# EasyEDA Pro project 高速串口TTL转CAN.eprj

# Schematic Schematic1
Create Date: 2024-04-29; Page Name: P1; Project Name: 高速串口TTL转CAN; Schematic Name: Schematic1; Update Date: 2024-04-30; Company: 嘉立创EDA; Page Size: A4; Version: V1.0
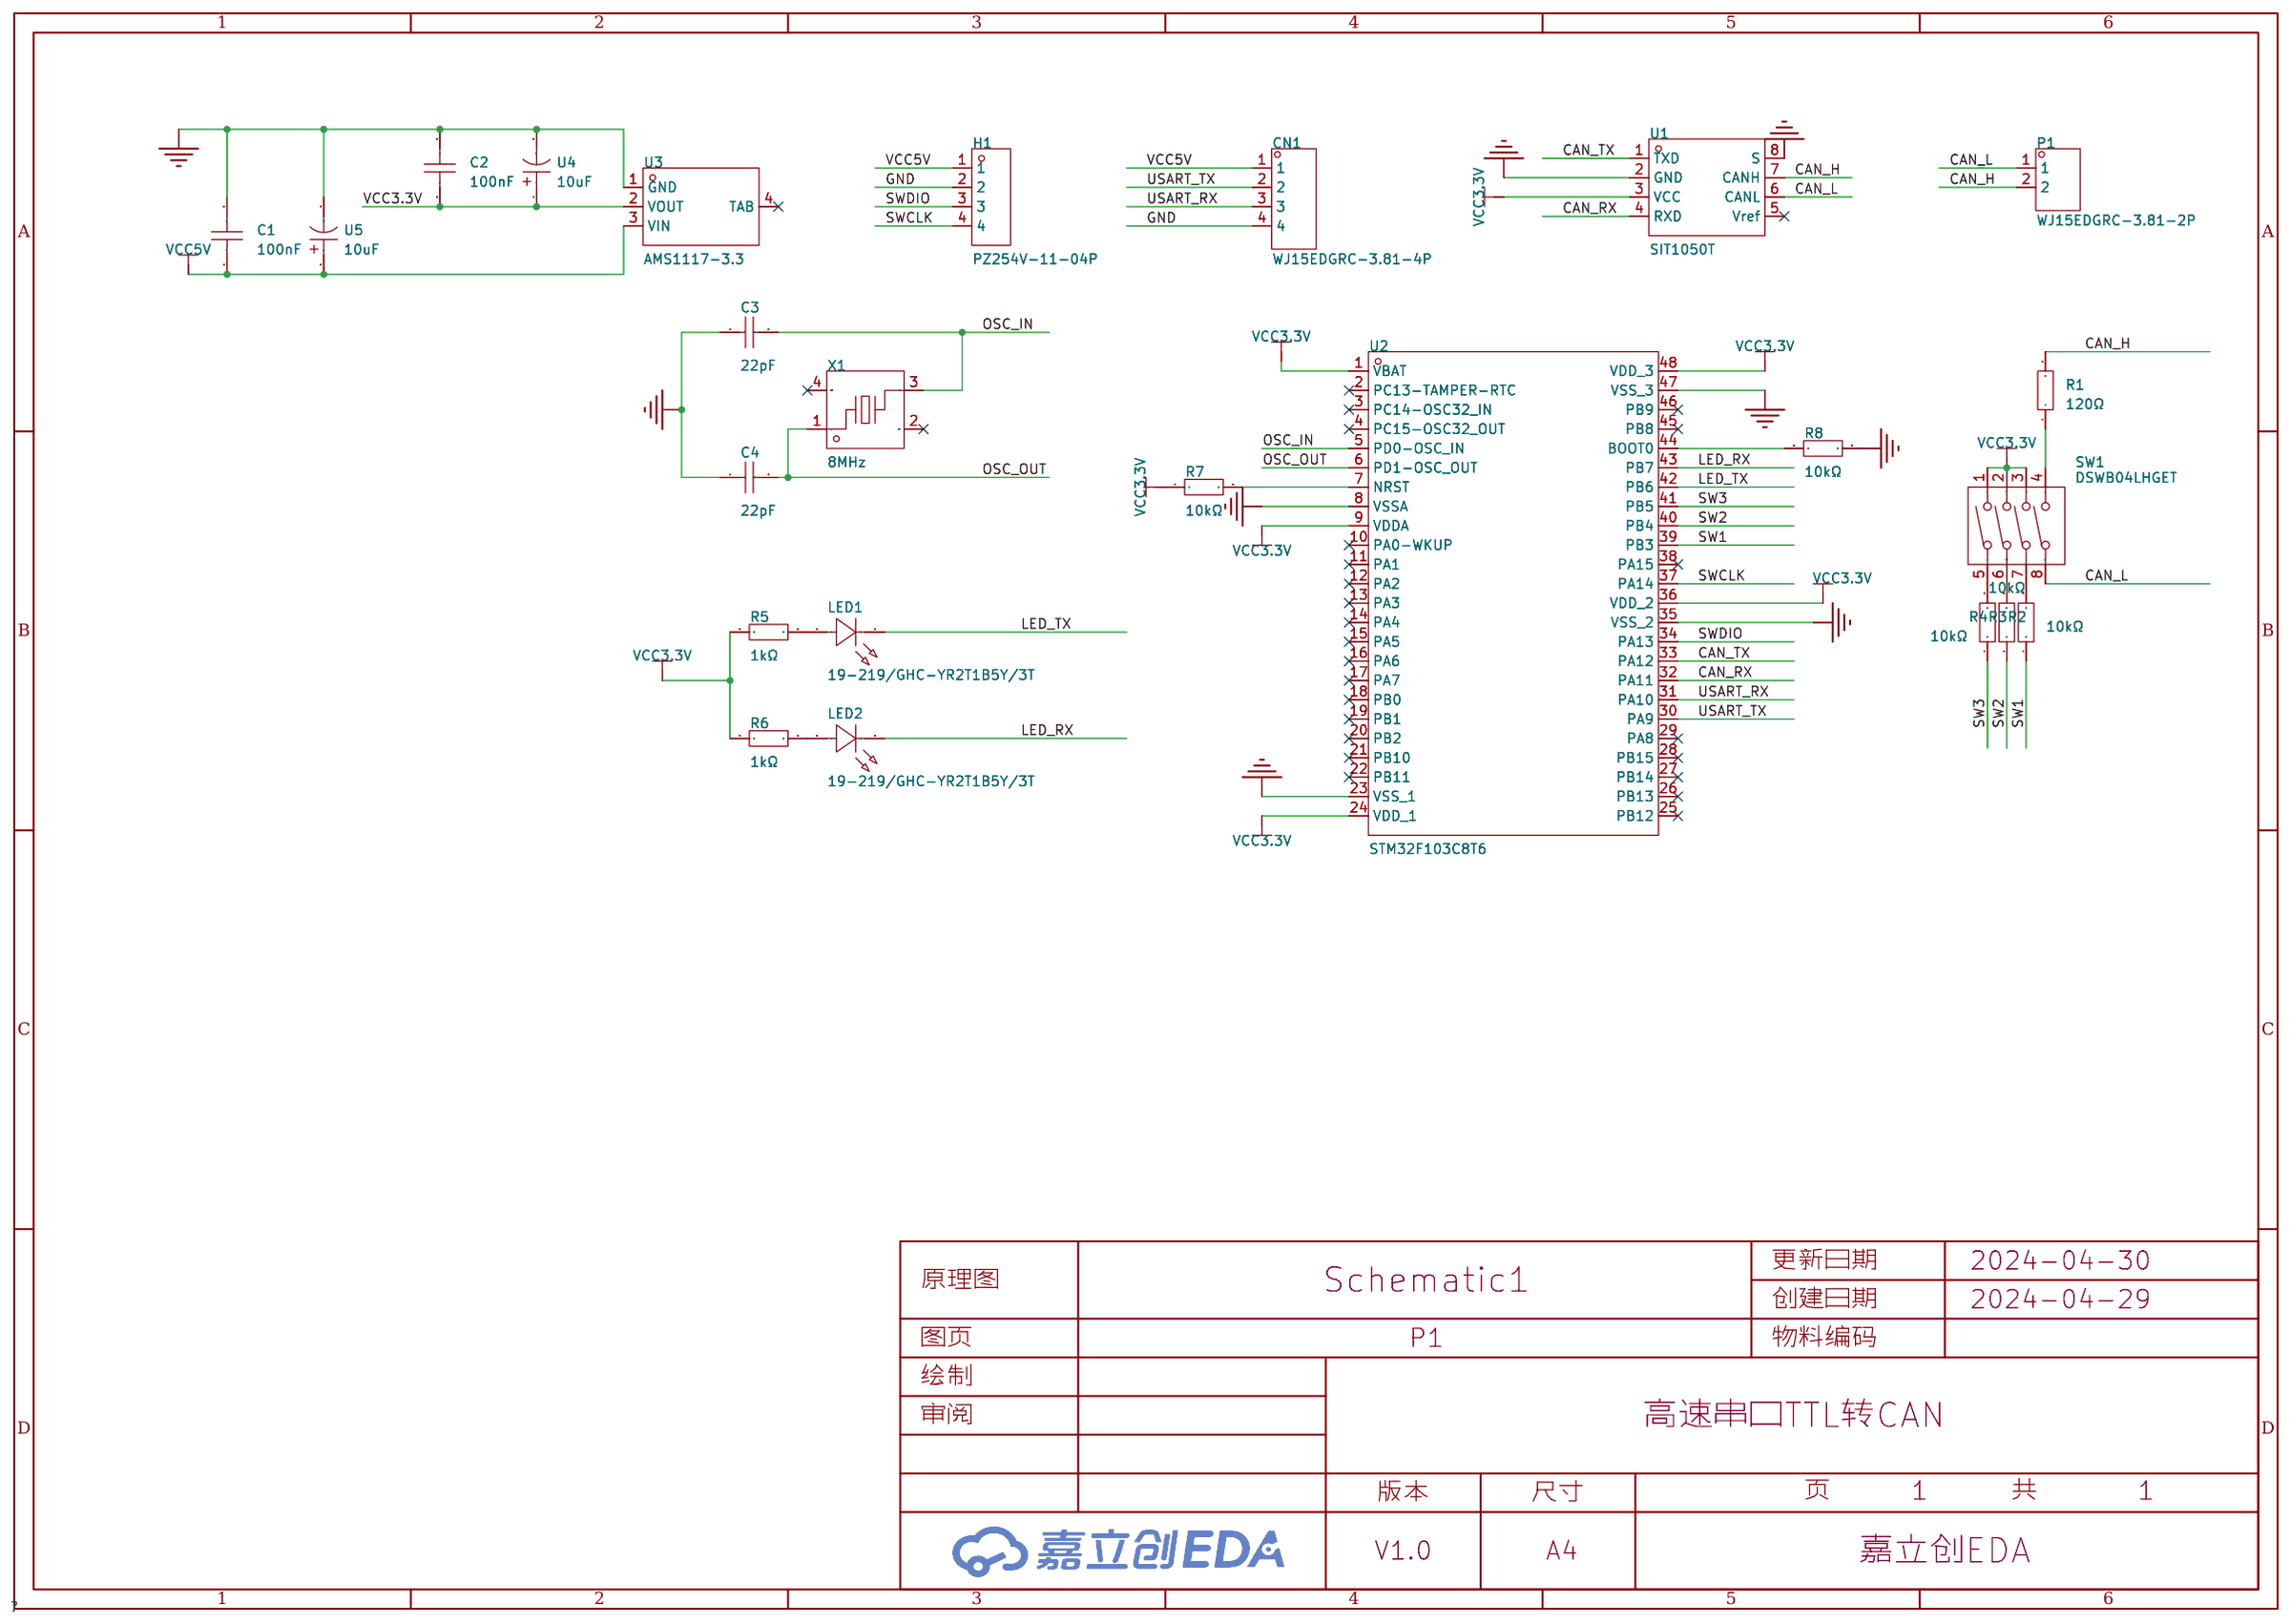
[diagram p0: schematic sheet]

## Parts
C1  100nF  [C0603]
C2  100nF  [C0603]
C3  22pF  [C0603]
C4  22pF  [C0603]
CN1  WJ15EDGRC-3.81-4P  [CONN-TH_WJ15EDGRC-3.81-4P]
H1  PZ254V-11-04P  [HDR-TH_4P-P2.54-V-M]
LED1  19-219/GHC-YR2T1B5Y/3T  [LED0603-RD_GREEN]
LED2  19-219/GHC-YR2T1B5Y/3T  [LED0603-RD_GREEN]
P1  WJ15EDGRC-3.81-2P  [CONN-TH_2P-P3.81_WJ15EDGRC-3.81-2P]
R1  120Ω  [R0603]
R2  10kΩ  [R0603]
R3  10kΩ  [R0603]
R4  10kΩ  [R0603]
R5  1kΩ  [R0603]
R6  1kΩ  [R0603]
R7  10kΩ  [R0603]
R8  10kΩ  [R0603]
SW1  DSWB04LHGET  [SW-TH_DSWB04LHGET]
U1  SIT1050T  [SO-8_L4.9-W3.9-P1.27-LS5.9-BL]
U2  STM32F103C8T6  [LQFP-48_L7.0-W7.0-P0.50-LS9.0-BL]
U3  AMS1117-3.3  [SOT-223-3_L6.5-W3.5-P3.05-LS7.0]
U4  10uF  [CAP-SMD_L2.0-W1.3-FD]
U5  10uF  [CAP-SMD_L2.0-W1.3-FD]
X1  8MHz  [OSC-SMD_4P-L3.2-W2.5-BL]

## Library data of the parts
C1 C2 = CC0603KRX7R9BB104: 容值:100nF;精度:±10%;额定电压:50V;材质(温度系数):X7R;; LCSC Part Name: 100nF ±10% 50V; Supplier Part: C14663; Manufacturer: YAGEO(国巨); Supplier Footprint: 0603; JLCPCB Part Class: 基础库; Datasheet: https://atta.szlcsc.com/upload/public/pdf/source/20180910/C282072_33301C7F631E79921B82A8DAC6BCC5B3.pdf; Supplier: LCSC; Tolerance: ±10%; Voltage Rated: 50V; Temperature Coefficient: X7R
C3 C4 = CC0603JRNPO9BN220: 容值:22pF;精度:±5%;额定电压:50V;材质(温度系数):NP0;; LCSC Part Name: 22pF ±5% 50V; Supplier Part: C105620; Manufacturer: YAGEO(国巨); Supplier Footprint: 0603; JLCPCB Part Class: 扩展库; Datasheet: https://atta.szlcsc.com/upload/public/pdf/source/20170505/1493957838062.pdf; Supplier: LCSC; Tolerance: ±5%; Voltage Rated: 50V; Temperature Coefficient: NP0
CN1 = WJ15EDGRC-3.81-4P: 连接器类型:板端/插座-闭口;结构:1x4P;间距:3.81mm;颜色:绿色;安装方式:弯针;排数:1;每排PIN数:4;; LCSC Part Name: 3.81mm 1x4P 排数:1 每排P数:4; Supplier Part: C7245; Manufacturer: KANGNEX(康奈克斯电气); Supplier Footprint: 弯插,P=3.81mm; JLCPCB Part Class: 扩展库; Datasheet: https://atta.szlcsc.com/upload/public/pdf/source/20191225/C7245_837ECEBE031BAC19A7EBD4F3127022E5.pdf; Supplier: LCSC; Connector Type: 板端/插座-闭口; Structure: 1x4P; Pitch: 3.81mm; Color: 绿色; Mounting Style: 弯针; Number of Rows: 1; Number of PINs Per Row: 4
H1 = PZ254V-11-04P: 插针结构:1x4P;间距:2.54mm;行距:-;圆针/方针:方针;安装类型:直插;排数:单排;总PIN位数:4P;额定电流:3A;额定电压:250V;配合针长度:6mm;塑高:2.5mm;端接针长度:3mm;触头材质:-;工作温度范围:-40℃~+105℃;颜色:黑色;; LCSC Part Name: 间距:2.54mm 1x4P 直插 方针; Supplier Part: C2691448; Manufacturer: XFCN(兴飞); Supplier Footprint: 插件,P=2.54mm; JLCPCB Part Class: 扩展库; Datasheet: https://atta.szlcsc.com/upload/public/pdf/source/20200309/C492403_F9F19131791D08044AD4F84F8E751A34.pdf; Supplier: LCSC; Pin Structure: 1x4P; Pitch: 2.54mm; Circluar Pins/Square Pins: 方针; Mounting Type: 直插; Number of Rows: 单排; Number of Pins: 4P; Current Rating (Max): 3A; Voltage Rating (Max): 250V; Length of Mating Pin: 6mm; Insulation Height: 2.5mm; Length of End Connection Pin: 3mm; Operating Temperature Range: -40℃~+105℃; Color: 黑色
LED1 LED2 = 19-219/GHC-YR2T1B5Y/3T: 发光颜色:绿色;正向电流:20mA;主波长:518nm;透镜颜色:无色透明透镜;; LCSC Part Name: 0603正贴式 绿灯(Iv=140~360mcd) @IF=20mA); Supplier Part: C2994781; Manufacturer: EVERLIGHT(亿光); Supplier Footprint: 0603; JLCPCB Part Class: 扩展库; Datasheet: https://atta.szlcsc.com/upload/public/pdf/source/20220419/8956FAA3247BD76AC23F3FF602030F9E.pdf; Supplier: LCSC; Emitted Color: 绿色; Forward Current: 20mA; Dominant Wavelength: 518nm; Peak Wavelength: 525nm; Lens Color: 无色透明透镜
P1 = WJ15EDGRC-3.81-2P: 连接器类型:板端/插座-闭口;结构:1x2P;间距:3.81mm;颜色:绿色;安装方式:弯针;排数:1;每排PIN数:2;; LCSC Part Name: 3.81mm 1x2P 排数:1 每排P数:2; Supplier Part: C8387; Manufacturer: KANGNEX(康奈克斯电气); Supplier Footprint: 弯插,P=3.81mm; JLCPCB Part Class: 扩展库; Datasheet: https://atta.szlcsc.com/upload/public/pdf/source/20191225/C8387_8EBAF10345D2762F0167C8753398EEFA.pdf; Supplier: LCSC; Connector Type: 板端/插座-闭口; Structure: 1x2P; Pitch: 3.81mm; Color: 绿色; Mounting Style: 弯针; Number of Rows: 1; Number of PINs Per Row: 2
R1 = 0603WAF1200T5E: 电阻类型:厚膜电阻;阻值:120Ω;精度:±1%;功率:100mW;最大工作电压:75V;温度系数:±100ppm/℃;; LCSC Part Name: 120Ω ±1% 100mW 厚膜电阻; Supplier Part: C22787; Manufacturer: UNI-ROYAL(厚声); Supplier Footprint: 0603; JLCPCB Part Class: 基础库; Datasheet: https://atta.szlcsc.com/upload/public/pdf/source/20200306/C422600_1E6D84923E4A46A82E41ADD87F860B5C.pdf; Supplier: LCSC; Type: 厚膜电阻; Tolerance: ±1%; Power(Watts): 100mW; Overload Voltage (Max): 75V; Temperature Coefficient: ±100ppm/℃; Operating Temperature Range: -55℃~+155℃
R2-R4 R7 R8 = 0603WAF1002T5E: 电阻类型:厚膜电阻;阻值:10kΩ;精度:±1%;功率:100mW;最大工作电压:75V;温度系数:±100ppm/℃;; LCSC Part Name: 厚膜电阻 10kΩ ±1% 100mW; Supplier Part: C25804; Manufacturer: UNI-ROYAL(厚声); Supplier Footprint: 0603; JLCPCB Part Class: 基础库; Datasheet: https://atta.szlcsc.com/upload/public/pdf/source/20200306/C422600_1E6D84923E4A46A82E41ADD87F860B5C.pdf; Supplier: LCSC; Type: 厚膜电阻; Tolerance: ±1%; Power(Watts): 100mW; Overload Voltage (Max): 75V; Temperature Coefficient: ±100ppm/℃; Operating Temperature Range: -55℃~+155℃
R5 R6 = 0603WAF1001T5E: 电阻类型:厚膜电阻;阻值:1kΩ;精度:±1%;功率:100mW;最大工作电压:75V;温度系数:±100ppm/℃;; LCSC Part Name: 1kΩ ±1% 100mW 厚膜电阻; Supplier Part: C21190; Manufacturer: UNI-ROYAL(厚声); Supplier Footprint: 0603; JLCPCB Part Class: 基础库; Datasheet: https://atta.szlcsc.com/upload/public/pdf/source/20200306/C422600_1E6D84923E4A46A82E41ADD87F860B5C.pdf; Supplier: LCSC; Type: 厚膜电阻; Tolerance: ±1%; Power(Watts): 100mW; Overload Voltage (Max): 75V; Temperature Coefficient: ±100ppm/℃; Operating Temperature Range: -55℃~+155℃
SW1 = DSWB04LHGET: 类型:平拨,凸起式;电路结构:单刀单掷;开关位数:4位;使用寿命:-;颜色:红色;; LCSC Part Name: 间距2.54mm 平拨,凸起式 4位拨码开关; Supplier Part: C99418; Manufacturer: YE; Supplier Footprint: 插件; JLCPCB Part Class: 扩展库; Datasheet: https://atta.szlcsc.com/upload/public/pdf/source/20220830/02827E67A8727938D957A3CE4C86C92D.pdf; Supplier: LCSC; Type: 平拨,凸起式; Circuit: 单刀单掷; Number of Positions: 4位; Lead Pitch: 2.54mm; Color: 红色
U1 = SIT1050T: 类型:收发器;数据速率:1Mbps;; LCSC Part Name: 1Mbps 4.5V~5.5V; Supplier Part: C313021; Manufacturer: SIT(芯力特); Supplier Footprint: SO-8; JLCPCB Part Class: 扩展库; Datasheet: https://atta.szlcsc.com/upload/public/pdf/source/20190522/C313021_F295A63AE262020D1D58DBA99C3629E3.pdf; Supplier: LCSC; Type: 收发器; Data Rate: 1Mbps; Supply Voltage: 4.5V~5.5V
U2 = STM32F103C8T6: CPU内核:CM3;程序存储容量:64KB;RAM总容量:20KB;GPIO端口数量:37;工作电压范围:2V~3.6V;CPU最大主频:72MHz;程序存储器类型:FLASH;; LCSC Part Name: STM32F103C8T6 MSL=3; Supplier Part: C8734; Manufacturer: ST(意法半导体); Supplier Footprint: LQFP-48(7x7); JLCPCB Part Class: 扩展库; Datasheet: https://atta.szlcsc.com/upload/public/pdf/source/20220812/8363ACEC51AD55ECEB84799464F7CB85.pdf; Supplier: LCSC; CPU Core: CM3; Program Storage Size: 64KB; RAM Size: 20KB; GPIO Ports Number: 37; Operating Voltage Range: 2V~3.6V; CPU Maximum Speed: 72MHz; Program Memory Type: FLASH; Operating Temperature Range: -40℃~+85℃; ADC (Bit): 12bit; Universal Serial Bus: 有; Peripheral/Function: 看门狗；DMA；看门狗；片载温度传感器; Watchdog: 有; Infrared Data Association: 有; Low-Voltage Detect: 有; Direct Memory Access: 有; Internal Oscillator: 有
U3 = AMS1117-3.3_C5250992: 输出类型：固定 输出极性：正 最大输入电压：18V 输出电压：3.3V 输出电流：1A 电源纹波抑制比(PSRR)：60dB@(120Hz)。当前应用较多领域：三端稳压器，机顶盒; Supplier Part: C5250992; Manufacturer: TWGMC(台湾迪嘉); Supplier Footprint: SOT-223-3L; JLCPCB Part Class: 扩展库; Datasheet: https://atta.szlcsc.com/upload/public/pdf/source/20221109/A58A92B07670E85D28928AE371260E8D.pdf; Supplier: LCSC
U4 U5 = F921A106MPA: 容值:10uF;精度:±20%;额定电压:10V;等效串联电阻:6Ω@100kHz;; LCSC Part Name: 10uF ±20% 10V; Supplier Part: C1955037; Manufacturer: Kyocera AVX; Supplier Footprint: 0805; JLCPCB Part Class: 扩展库; Datasheet: https://atta.szlcsc.com/upload/public/pdf/source/20211207/7C5E2E325E512F406E5C86958F1291E6.pdf; Supplier: LCSC; Tolerance: ±20%; Rated Voltage: 10V; Leakage Current(DCL): 500nA@20℃,1min; Ripple Current: 28mA@100kHz; Equivalent Series Resistance(ESR): 6Ω@100kHz; Operating Temperature: -55℃~+125℃
X1 = X32258MOB4SI: 晶振类型:贴片晶振;频率:8MHz;常温频差:±10ppm;外接负载电容:12pF;频率稳定度(全温):±20ppm;; LCSC Part Name: 8MHz ±10ppm 12pF; Supplier Part: C2682775; Manufacturer: YXC(扬兴晶振); Supplier Footprint: SMD3225-4P; JLCPCB Part Class: 扩展库; Datasheet: https://atta.szlcsc.com/upload/public/pdf/source/20240329/19D5F850207469550BEB00D7DFEDBC7A.pdf; Supplier: LCSC; Crystal Type: 贴片晶振; Normal temperature Frequency Tolerance: ±10ppm; External load capacitor: 12pF; Frequency Stability(Full temperature range): ±20ppm; Equivalent Series Resistance (ESR): 150Ω; Operating Temperature: -40℃~+85℃

## Nets
GND: C1.2 C2.2 C3.1 C4.1 CN1.4 H1.2 R8.2 U1.2(GND) U1.8(S) U2.8(VSSA) U2.23(VSS_1) U2.35(VSS_2) U2.47(VSS_3) U3.1(GND) U4.2 U5.2
VCC3.3V: C2.1 R5.1 R6.1 R7.1 SW1.1 SW1.2 SW1.3 U1.3(VCC) U2.1(VBAT) U2.9(VDDA) U2.24(VDD_1) U2.36(VDD_2) U2.48(VDD_3) U3.2(VOUT) U4.1
VCC5V: C1.1 CN1.1 H1.1 U3.3(VIN) U5.1
CAN_H: P1.2 R1.2 U1.7(CANH)
CAN_L: P1.1 SW1.8 U1.6(CANL)
CAN_RX: U1.4(RXD) U2.32(PA11)
CAN_TX: U1.1(TXD) U2.33(PA12)
LED_RX: LED2.1(K) U2.43(PB7)
LED_TX: LED1.1(K) U2.42(PB6)
OSC_IN: C3.2 U2.5(PD0-OSC_IN) X1.3
OSC_OUT: C4.2 U2.6(PD1-OSC_OUT) X1.1
SW1: R2.1 U2.39(PB3)
SW2: R3.1 U2.40(PB4)
SW3: R4.1 U2.41(PB5)
SWCLK: H1.4 U2.37(PA14)
SWDIO: H1.3 U2.34(PA13)
USART_RX: CN1.3 U2.31(PA10)
USART_TX: CN1.2 U2.30(PA9)
$1N1995: R1.1 SW1.4
$1N2288: LED1.2(A) R5.2
$1N2327: LED2.2(A) R6.2
$1N2517: R7.2 U2.7(NRST)
$1N2596: R8.1 U2.44(BOOT0)
$1N3262: R4.2 SW1.5
$1N3264: R3.2 SW1.6
$1N3266: R2.2 SW1.7

Not connected (* = marked no-connect by the designer): U1 5(Vref)*; U2 2(PC13-TAMPER-RTC)* 3(PC14-OSC32_IN)* 4(PC15-OSC32_OUT)* 10(PA0-WKUP)* 11(PA1)* 12(PA2)* 13(PA3)* 14(PA4)* 15(PA5)* 16(PA6)* 17(PA7)* 18(PB0)* 19(PB1)* 20(PB2)* 21(PB10)* 22(PB11)* 25(PB12)* 26(PB13)* 27(PB14)* 28(PB15)* 29(PA8)* 38(PA15)* 45(PB8)* 46(PB9)*; U3 4(TAB)*; X1 2(GND)* 4(GND)*

# Board PCB1
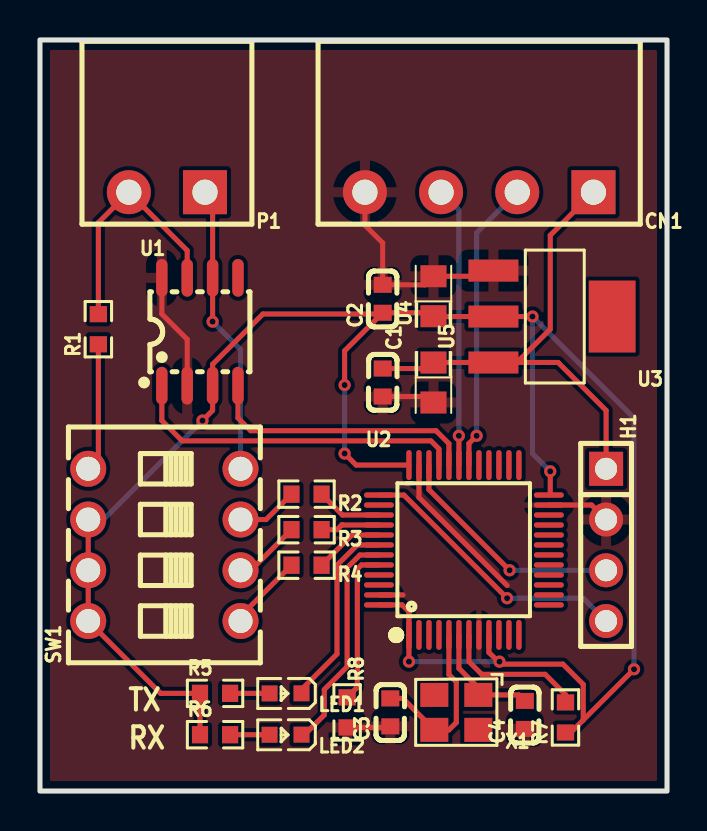
[diagram p1: board, top side]
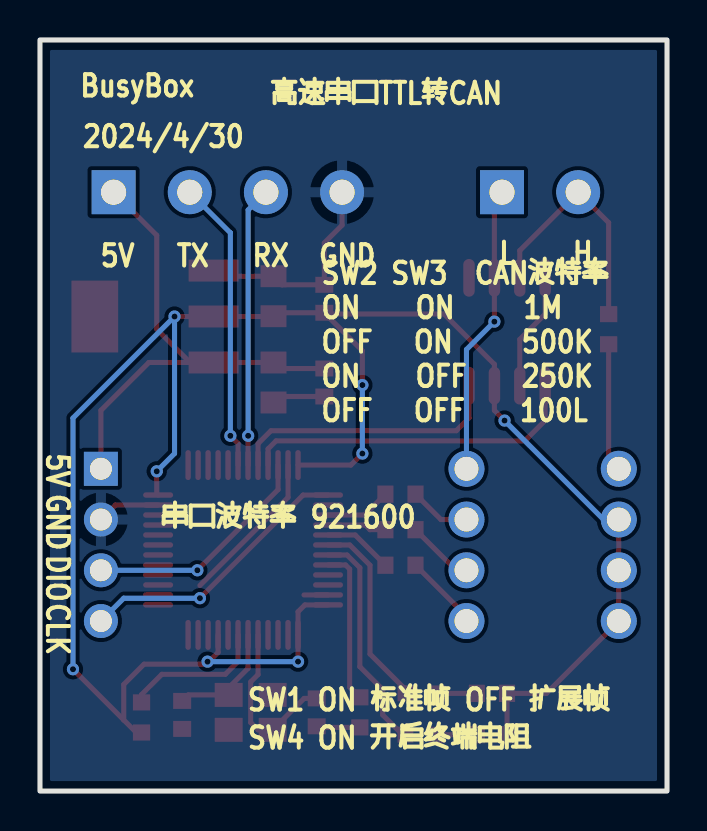
[diagram p2: board, bottom side, seen from below]

Outline 31.37 x 37.59 mm; copper layers: Top Layer, Bottom Layer. Coordinates in mm from the lower left corner of the outline.
Outline path: rectangle 0,37.59 31.37,0
Stack: Top Layer 0.035mm / Dielectric1 1.51mm FR4 er 4.5 / Bottom Layer 0.035mm

## Design rules (mm)
template: JLCPCB Capability(Two Layers Board)
spacing copperThickness1oz (default): track to track 0.102, other pairs 0.152 to 0.3
spacing copperThickness2oz: track to track 0.203, other pairs 0.152 to 0.3
track width copperThickness1oz (default): min 0.127, default 0.254, max 2.54
track width copperThickness2oz: min 0.203, default 0.254, max 2.54
differential pair differentialPair (default): width min 0.127, default 0.254, max 2.54; gap min 0.152, default 0.152
via viaSize (default): diameter min 0.5, default 0.61, max 10; hole min 0.3, default 0.305, max 6.3

## Placement (name value [footprint] x y rotation side)
C1  100nF  [C0603]  17.15 20.45 270 top
C2  100nF  [C0603]  17.15 24.64 90 top
C3  22pF  [C0603]  17.53 3.94 90 top
C4  22pF  [C0603]  24.26 3.81 90 top
CN1  WJ15EDGRC-3.81-4P  [CONN-TH_WJ15EDGRC-3.81-4P]  21.97 29.97 180 top
H1  PZ254V-11-04P  [HDR-TH_4P-P2.54-V-M]  28.32 12.32 270 top
LED1  19-219/GHC-YR2T1B5Y/3T  [LED0603-RD_GREEN]  12.28 4.89 180 top
LED2  19-219/GHC-YR2T1B5Y/3T  [LED0603-RD_GREEN]  12.28 2.82 180 top
P1  WJ15EDGRC-3.81-2P  [CONN-TH_2P-P3.81_WJ15EDGRC-3.81-2P]  6.35 29.97 180 top
R1  120Ω  [R0603]  2.92 23.11 90 top
R2  10kΩ  [R0603]  13.34 14.86 180 top
R3  10kΩ  [R0603]  13.34 13.08 180 top
R4  10kΩ  [R0603]  13.34 11.3 180 top
R5  1kΩ  [R0603]  8.76 4.89 0 top
R6  1kΩ  [R0603]  8.76 2.82 0 top
R7  10kΩ  [R0603]  26.29 3.68 90 top
R8  10kΩ  [R0603]  15.37 3.94 270 top
SW1  DSWB04LHGET  [SW-TH_DSWB04LHGET]  6.22 12.32 90 top
U1  SIT1050T  [SO-8_L4.9-W3.9-P1.27-LS5.9-BL]  8 22.99 0 top
U2  STM32F103C8T6  [LQFP-48_L7.0-W7.0-P0.50-LS9.0-BL]  21.21 12.06 0 top
U3  AMS1117-3.3  [SOT-223-3_L6.5-W3.5-P3.05-LS7.0]  25.65 23.75 180 top
U4  10uF  [CAP-SMD_L2.0-W1.3-FD]  19.69 24.77 90 top
U5  10uF  [CAP-SMD_L2.0-W1.3-FD]  19.69 20.45 270 top
X1  8MHz  [OSC-SMD_4P-L3.2-W2.5-BL]  20.83 3.94 180 top

## Footprints (pads in the part's own frame, mm; a bottom-side part is the same pattern mirrored in y, then rotated)
C0603
  rect 0.8x0.9 smd: 1(-0.7,0) 2(0.7,0)
CAP-SMD_L2.0-W1.3-FD
  rect 1.1x1.3 smd: 1(-1,0) 2(1,0)
CONN-TH_2P-P3.81_WJ15EDGRC-3.81-2P
  rect 2.2x2.2 hole 1.26: 1(-1.905,0)
  round 2.2 hole 1.26: 2(1.905,0)
CONN-TH_WJ15EDGRC-3.81-4P
  rect 2.2x2.2 hole 1.26: 1(-5.715,0)
  round 2.2 hole 1.26: 2(-1.905,0) 3(1.905,0) 4(5.715,0)
HDR-TH_4P-P2.54-V-M
  rect 1.7x1.7 hole 1.1: 1(-3.81,0)
  round 1.7 hole 1.1: 2(-1.27,0) 3(1.27,0) 4(3.81,0)
LED0603-RD_GREEN
  rect 0.8x0.8 smd: 1(-0.799,-0.004) 2(0.799,0.004)
LQFP-48_L7.0-W7.0-P0.50-LS9.0-BL
  oval 0.27x1.5 smd: 1(-2.75,-4.25) 2(-2.25,-4.25) 3(-1.75,-4.25) 4(-1.25,-4.25) 5(-0.75,-4.25) 6(-0.25,-4.25) 7(0.25,-4.25) 8(0.75,-4.25) 9(1.25,-4.25) 10(1.75,-4.25) 11(2.25,-4.25) 12(2.75,-4.25) 25(2.75,4.25) 26(2.25,4.25) 27(1.75,4.25) 28(1.25,4.25) 29(0.75,4.25) 30(0.25,4.25) 31(-0.25,4.25) 32(-0.75,4.25) 33(-1.25,4.25) 34(-1.75,4.25) 35(-2.25,4.25) 36(-2.75,4.25)
  oval 1.5x0.27 smd: 13(4.25,-2.75) 14(4.25,-2.25) 15(4.25,-1.75) 16(4.25,-1.25) 17(4.25,-0.75) 18(4.25,-0.25) 19(4.25,0.25) 20(4.25,0.75) 21(4.25,1.25) 22(4.25,1.75) 23(4.25,2.25) 24(4.25,2.75) 37(-4.25,2.75) 38(-4.25,2.25) 39(-4.25,1.75) 40(-4.25,1.25) 41(-4.25,0.75) 42(-4.25,0.25) 43(-4.25,-0.25) 44(-4.25,-0.75) 45(-4.25,-1.25) 46(-4.25,-1.75) 47(-4.25,-2.25) 48(-4.25,-2.75)
OSC-SMD_4P-L3.2-W2.5-BL
  rect 1.4x1.2 smd: 1(-1.1,-0.875) 2(1.1,-0.875) 3(1.1,0.875) 4(-1.1,0.875)
R0603
  rect 0.806x0.864 smd: 1(-0.753,0) 2(0.753,0)
SO-8_L4.9-W3.9-P1.27-LS5.9-BL
  oval 0.574x1.888 smd: 1(-1.905,-2.699) 2(-0.635,-2.699) 3(0.635,-2.699) 4(1.905,-2.699) 5(1.905,2.699) 6(0.635,2.699) 7(-0.635,2.699) 8(-1.905,2.699)
SOT-223-3_L6.5-W3.5-P3.05-LS7.0
  rect 2.5x1.1 smd: 1(2.97,-2.3) 2(2.97,0) 3(2.97,2.3)
  rect 2.34x3.6 smd: 4(-2.97,0)
SW-TH_DSWB04LHGET
  round 1.8 hole 1.2: 1(-3.81,3.81) 2(-1.27,3.81) 3(1.27,3.81) 4(3.81,3.81) 5(-3.81,-3.81) 6(-1.27,-3.81) 7(1.27,-3.81) 8(3.81,-3.81)

## Nets
As in the schematic.

Pads without a net: U1 5; U2 2 3 4 10 11 12 13 14 15 16 17 18 19 20 21 22 25 26 27 28 29 38 45 46; U3 4; X1 2 4

## Via types
v1: diameter 0.61, hole 0.305, Top Layer to Bottom Layer, 13 vias

## Routing (per net, layer and track width the routed paths; a pad name or vN(x,y) marks a point on that pad's centre or on a via; arc(x,y) is an arc through that point)
GND: length 33.8
  Top Layer w0.254: U2.47 18.16,9.81 ; 23.37,10.29 18.96,14.7 U2.35 ; C1.2 19.38,19.75 U5.2 ; U3.1 22.4,25.77 U4.2 19.26,25.34 C2.2 17.15,27.43 16.26,28.32 CN1.4 ; H1.2 27.59,14.31 U2.23 ; U1.8 6.1,23.88 7.37,22.61 U1.2 ; C3.1 17.47,3.18 R8.2
VCC3.3V: length 104
  Top Layer w0.254: 17.08,23.88 15.24,22.03 v1(15.24,20.32) ; 17.08,23.88 C2.1 19.51,23.94 U4.1 19.7,23.75 U3.2 v1(24.64,23.75) ; 17.08,23.88 11.15,23.88 8.64,21.36 U1.3 8.64,19.05 v1(8.13,18.54) ; U2.24 25.53,14.88 v1(25.53,16) ; v1(15.24,16.89) 15.82,16.31 U2.36 ; R6.1 R5.1 6.03,4.89 SW1.1 SW1.2 SW1.3 ; 22.99,6.41 23.05,6.35 26.16,6.35 27.18,5.33 27.18,3.56 ; 22.99,6.41 v1(22.99,6.48) ; 22.99,6.41 22.46,6.94 U2.9 ; 27.18,3.56 26.55,2.93 R7.1 ; 27.18,3.56 v1(29.72,6.1) ; v1(18.46,6.48) U2.1 18.46,8.97 18.12,9.31 U2.48
  Bottom Layer w0.254: v1(25.53,16) 24.64,16.89 v1(24.64,23.75) 29.72,18.67 v1(29.72,6.1) ; v1(8.13,18.54) 3.18,13.59 SW1.3 ; v1(22.99,6.48) v1(18.46,6.48) ; v1(15.24,16.89) v1(15.24,20.32)
VCC5V: length 25.3
  Top Layer w0.254: 23.86,21.45 25.92,21.45 28.32,19.05 H1.1 ; 23.86,21.45 U3.3 19.69,21.45 U5.1 19.38,21.15 C1.1 ; 23.86,21.45 25.53,23.11 25.53,27.81 CN1.1
CAN_H: length 12.2
  Top Layer w0.254: R1.2 2.92,28.45 P1.2 7.37,27.05 U1.7
CAN_L: length 14.6
  Top Layer w0.254: P1.1 8.64,29.59 U1.6 v1(8.64,23.5)
  Bottom Layer w0.254: v1(8.64,23.5) 10.03,22.1 10.03,16.13
CAN_RX: length 13.8
  Top Layer w0.254: U1.4 9.91,18.67 10.54,18.03 19.81,18.03 20.46,17.39 U2.32
CAN_TX: length 17
  Top Layer w0.254: U2.33 19.96,17.12 19.56,17.53 7.11,17.53 6.1,18.54 U1.1
LED_RX: length 11.2
  Top Layer w0.254: U2.43 16.01,11.81 15.37,11.18 15.37,6.22 14.22,5.08 14.22,3.81 13.24,2.82 LED2.1
LED_TX: length 9.7
  Top Layer w0.254: LED1.1 13.08,5.08 14.86,6.86 14.86,11.3 15.87,12.31 U2.42
OSC_IN: length 8.6
  Top Layer w0.254: U2.5 20.46,5.83 20.83,5.46 20.83,3.43 20.46,3.06 X1.3 18.15,4.64 C3.2
OSC_OUT: length 5.9
  Top Layer w0.254: U2.6 20.96,6.14 21.93,5.17 X1.1 23.96,4.81 C4.2
SW1: length 3.3
  Top Layer w0.254: R2.1 15.13,13.81 U2.39
SW2: length 3
  Top Layer w0.254: U2.40 15.13,13.31 15.11,13.33 14.86,13.08 R3.1
SW3: length 3.5
  Top Layer w0.254: R4.1 15.6,12.81 U2.41
SWCLK: length 14
  Top Layer w0.254: U2.37 18.21,14.81 v1(23.37,9.65)
  Bottom Layer w0.254: v1(23.37,9.65) 27.18,9.65 H1.4
SWDIO: length 11.8
  Top Layer w0.254: v1(23.5,11.05) 19.46,15.08 U2.34
  Bottom Layer w0.254: v1(23.5,11.05) H1.3
USART_RX: length 14
  Top Layer w0.254: U2.31 20.96,17.78 v1(20.96,17.78)
  Bottom Layer w0.254: v1(20.96,17.78) 20.96,29.08 CN1.3
USART_TX: length 14.7
  Top Layer w0.254: v1(21.84,17.78) 21.46,17.39 U2.30
  Bottom Layer w0.254: v1(21.84,17.78) 21.84,27.94 CN1.2
$1N1995: length 6.4
  Top Layer w0.254: R1.1 2.92,16.64 SW1.4
$1N2288: length 2
  Top Layer w0.254: LED1.2 11.48,4.89 R5.2
$1N2327: length 2
  Top Layer w0.254: R6.2 11.48,2.82 LED2.2
$1N2517: length 7.2
  Top Layer w0.254: R7.2 26.29,4.83 25.27,5.84 22.1,5.84 21.46,6.48 U2.7
$1N2596: length 7.8
  Top Layer w0.254: R8.1 15.88,5.2 15.88,11.11 16.08,11.31 U2.44
$1N3262: length 3.8
  Top Layer w0.254: 10.03,8.51 10.03,8.75 R4.2
$1N3264: length 3.4
  Top Layer w0.254: R3.2 10.55,11.05 10.03,11.05
$1N3266: length 3.1
  Top Layer w0.254: R2.2 11.31,13.59 10.03,13.59

## Copper pours and planes (outline as drawn; the poured copper is in the pictures)
GND on Top Layer: 0,37.59 31.37,37.59 31.37,0 0,0
GND on Bottom Layer: 0,37.59 31.37,37.59 31.37,0 0,0

## Text on the board
Bottom Silkscreen Layer: H | L | GND | RX | TX | 5V | 2024/4/30 | BusyBox | DIO | CLK | SW2 SW3  CAN波特率 / ON    ON     1M / OFF   ON     500K / ON    OFF    250K / OFF   OFF    100L | 高速串口TTL转CAN | SW1 ON 标准帧 OFF 扩展帧 | SW4 ON 开启终端电阻 | 串口波特率 921600
Top Silkscreen Layer: TX | RX
